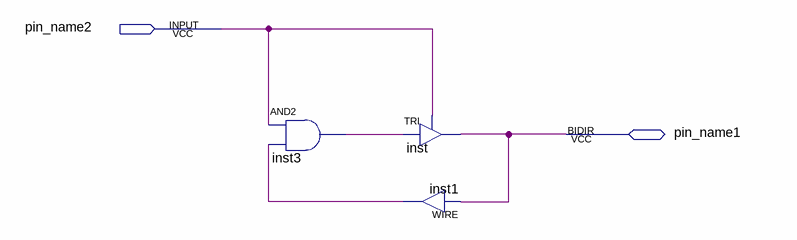
[diagram p0: schematic sheet]
// Quartus schematic Block3.bdf as structural Verilog: 3 symbols, 2 pins
module Block3 (
  input  pin_name2,
  inout  pin_name1
);

  wire inst1_out, inst3_out;

  and inst3 (inst3_out, pin_name2, inst1_out);
  TRI inst (.IN(inst3_out), .OE(pin_name2), .OUT(pin_name1));
  assign inst1_out = pin_name1;  // WIRE inst1
endmodule
